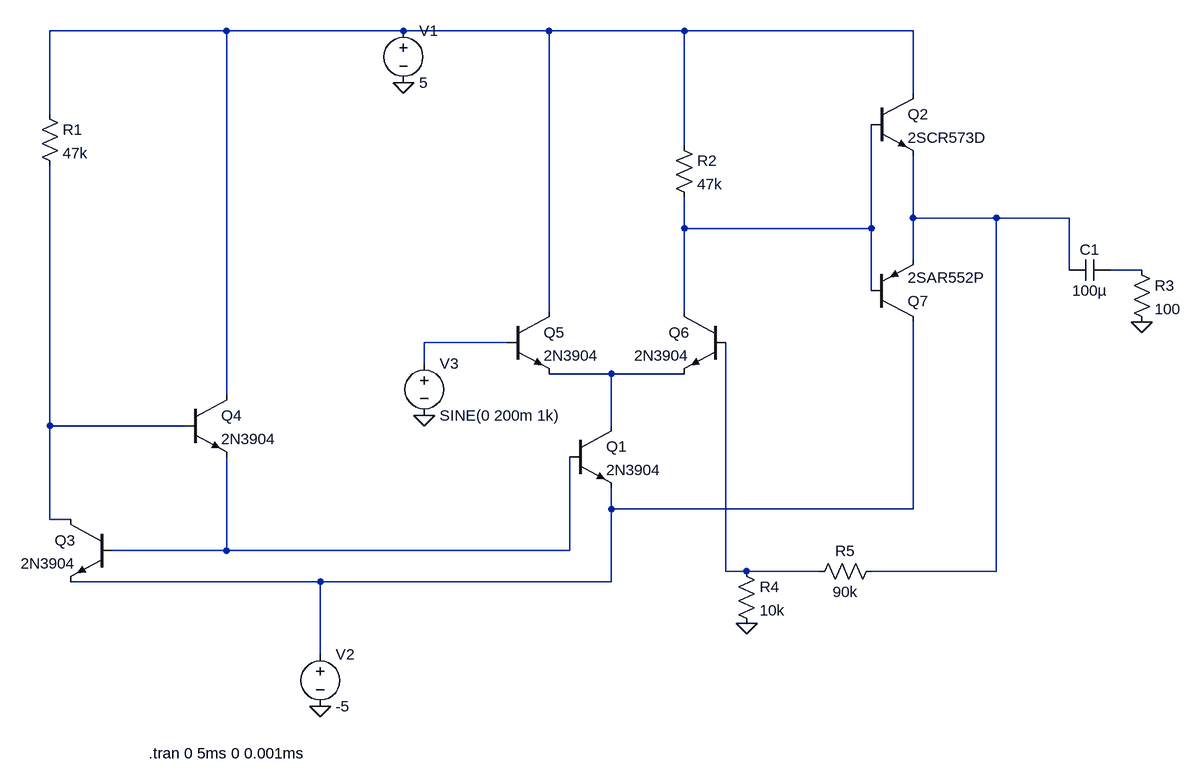
[diagram p0: schematic Az6 part 2.asc]
Az6 part 2.asc, the LTspice schematic file:
Version 4
SHEET 1 1380 824
WIRE -96 -304 -368 -304
WIRE 176 -304 -96 -304
WIRE 400 -304 176 -304
WIRE 608 -304 400 -304
WIRE 960 -304 608 -304
WIRE 960 -208 960 -304
WIRE -368 -176 -368 -304
WIRE 608 -128 608 -304
WIRE 960 -16 960 -112
WIRE 1088 -16 960 -16
WIRE 1200 -16 1088 -16
WIRE 608 0 608 -48
WIRE 896 0 896 -160
WIRE 896 0 608 0
WIRE 960 48 960 -16
WIRE 1200 64 1200 -16
WIRE 1312 64 1264 64
WIRE 896 96 896 0
WIRE 400 128 400 -304
WIRE 608 128 608 0
WIRE 336 176 208 176
WIRE 208 208 208 176
WIRE 496 224 400 224
WIRE 608 224 496 224
WIRE -96 256 -96 -304
WIRE -368 304 -368 -96
WIRE -160 304 -368 304
WIRE 496 304 496 224
WIRE 496 432 496 400
WIRE 960 432 960 144
WIRE 960 432 496 432
WIRE -368 448 -368 304
WIRE -336 448 -368 448
WIRE -96 496 -96 352
WIRE -96 496 -272 496
WIRE 432 496 432 352
WIRE 432 496 -96 496
WIRE 672 528 672 176
WIRE 704 528 672 528
WIRE 816 528 704 528
WIRE 1088 528 1088 -16
WIRE 1088 528 896 528
WIRE 48 544 -336 544
WIRE 496 544 496 432
WIRE 496 544 48 544
WIRE 48 656 48 544
FLAG 1312 144 0
FLAG 704 608 0
FLAG 48 736 0
FLAG 176 -224 0
FLAG 208 288 0
SYMBOL npn 432 304 R0
SYMATTR InstName Q1
SYMATTR Value 2N3904
SYMBOL npn 896 -208 R0
SYMATTR InstName Q2
SYMATTR Value 2SCR573D
SYMBOL npn -272 448 M0
SYMATTR InstName Q3
SYMATTR Value 2N3904
SYMBOL npn -160 256 R0
SYMATTR InstName Q4
SYMATTR Value 2N3904
SYMBOL npn 336 128 R0
SYMATTR InstName Q5
SYMATTR Value 2N3904
SYMBOL npn 672 128 M0
SYMATTR InstName Q6
SYMATTR Value 2N3904
SYMBOL pnp 896 144 M180
SYMATTR InstName Q7
SYMATTR Value 2SAR552P
SYMBOL res -384 -192 R0
SYMATTR InstName R1
SYMATTR Value 47k
SYMBOL res 592 -144 R0
SYMATTR InstName R2
SYMATTR Value 47k
SYMBOL res 1296 48 R0
SYMATTR InstName R3
SYMATTR Value 100
SYMBOL res 688 512 R0
SYMATTR InstName R4
SYMATTR Value 10k
SYMBOL res 912 512 R90
WINDOW 0 0 56 VBottom 2
WINDOW 3 32 56 VTop 2
SYMATTR InstName R5
SYMATTR Value 90k
SYMBOL cap 1264 48 R90
WINDOW 0 0 32 VBottom 2
WINDOW 3 32 32 VTop 2
SYMATTR InstName C1
SYMATTR Value 100µ
SYMBOL voltage 176 -320 R0
SYMATTR InstName V1
SYMATTR Value 5
SYMBOL voltage 48 640 R0
SYMATTR InstName V2
SYMATTR Value -5
SYMBOL voltage 208 192 R0
WINDOW 123 0 0 Left 0
WINDOW 39 0 0 Left 0
SYMATTR InstName V3
SYMATTR Value SINE(0 200m 1k)
TEXT -216 808 Left 2 !.tran 0 5ms 0 0.001ms

The netlist it stands for:
* Az6 part 2.asc
Q1 N006 N009 N008 0 2N3904
Q2 N001 N003 N002 0 2SCR573D
Q3 N007 N009 N008 0 2N3904
Q4 N001 N007 N009 0 2N3904
Q5 N001 N005 N006 0 2N3904
Q6 N003 N010 N006 0 2N3904
Q7 N008 N003 N002 0 2SAR552P
R1 N001 N007 47k
R2 N001 N003 47k
R3 N004 0 100
R4 N010 0 10k
R5 N002 N010 90k
C1 N004 N002 100µ
V1 N001 0 5
V2 N008 0 -5
V3 N005 0 SINE(0 200m 1k)
.model NPN NPN
.model PNP PNP
.lib standard.bjt
.tran 0 5ms 0 0.001ms
.backanno
.end